# Altium schematic sheet Battery Load Share V2.SchDoc
size A; SheetNumber: 2; SheetTotal: 9
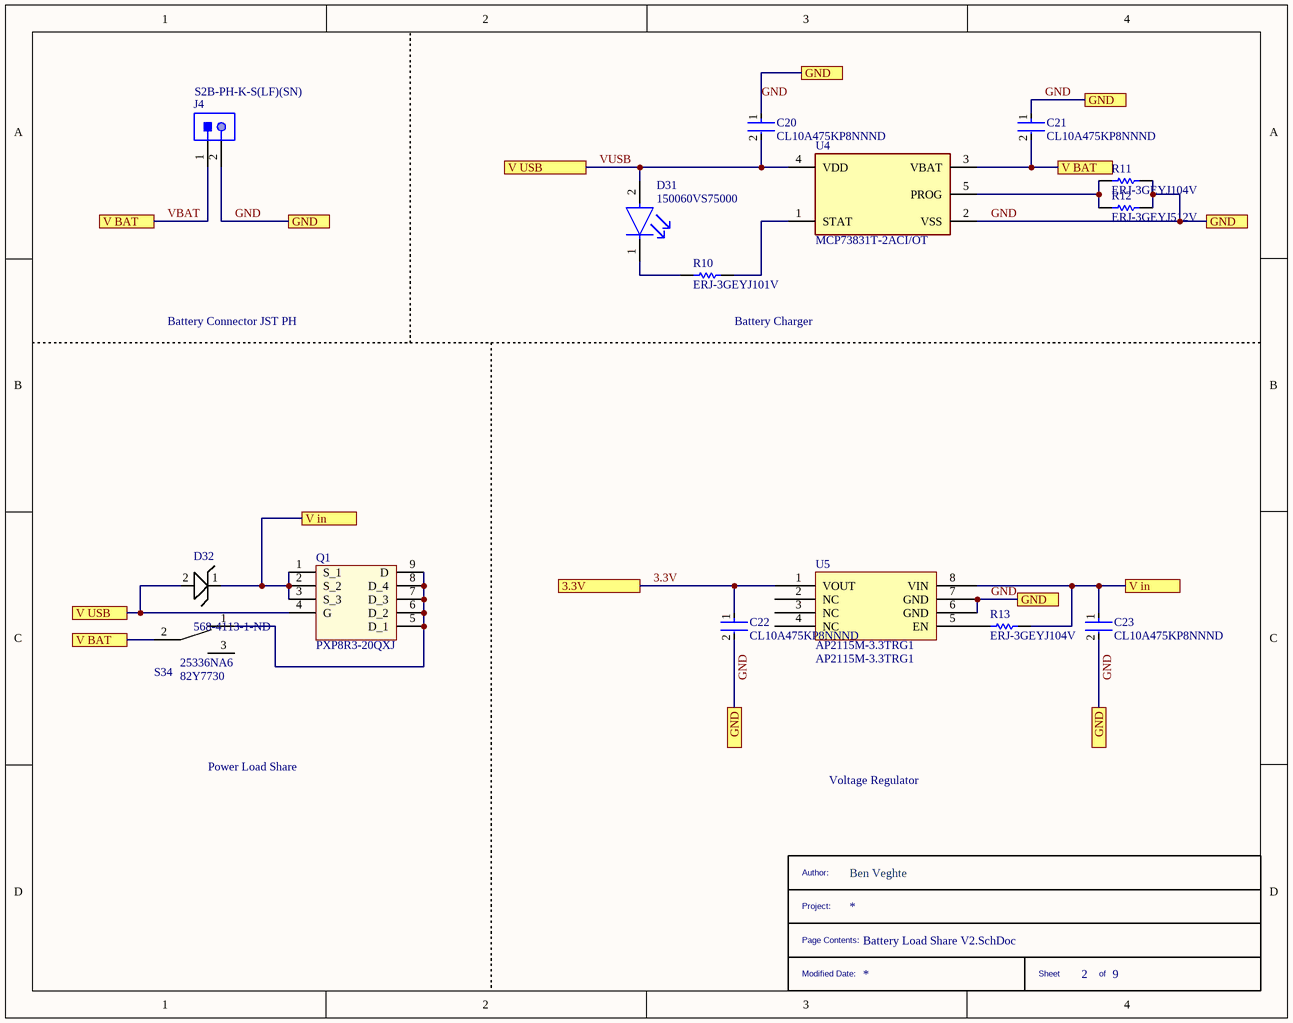
[diagram p0: Battery Load Share V2.SchDoc]

## Parts
*  __TITLE_BLOCK__  (value not drawn)  (graphical)
C20  CL10A475KP8NNND  [FP-CL10-IPC_C]
C21  CL10A475KP8NNND  [FP-CL10-IPC_C]
C22  CL10A475KP8NNND  [FP-CL10-IPC_C]
C23  CL10A475KP8NNND  [FP-CL10-IPC_C]
D31  150060VS75000  [FP-150060VS75000-MFG]
D32  Supplier Part Number 1: 568-4113-1-ND  [PMEG2010AEJ]  (hidden comment: PMEG2010AEJ115)
J4  S2B-PH-K-S(LF)(SN)  [JST-S2B-PH-K-S_V]
Q1  PXP8R3-20QXJ  [PXP8R3-20QXJ]
R10  ERJ-3GEYJ101V  [RESC1608X55X30LL15T15]
R11  ERJ-3GEYJ104V  [RESC1608X55X30NL15T15]
R12  ERJ-3GEYJ512V  [RESC1608X55X30LL15T15]
R13  ERJ-3GEYJ104V  [RESC1608X55X30NL15T15]
S34  25336NA6  Supplier Part Number 1: 82Y7730  [25336NA6]
U4  MCP73831T-2ACI/OT  [FP-C04-091-OT-IPC_B]
U5  AP2115M-3.3TRG1  [AP2115M-3.3TRG1]

## Ports
3.3V, GND, V BAT, V in, V USB

## Nets
3.3V: C22.1 U5.1(VOUT) ; port 3.3V
GND: C20.1 C21.1 C22.2 C23.2 J4.2 R11.2 R12.2 U4.2(VSS) U5.6(GND) U5.7(GND) ; port GND
V in: C23.1 D32.1 Q1.1(S_1) Q1.2(S_2) Q1.3(S_3) R13.2 U5.8(VIN) ; port V in
VBAT: C21.2 J4.1 S34.2 U4.3(VBAT) ; port V BAT
VUSB: C20.2 D31.2(A) D32.2 Q1.4(G) U4.4(VDD) ; port V USB
NetD31_1: D31.1(C) R10.1
NetQ1_5: Q1.5(D_1) Q1.6(D_2) Q1.7(D_3) Q1.8(D_4) Q1.9(D) S34.1
NetR10_2: R10.2 U4.1(STAT)
NetR11_1: R11.1 R12.1 U4.5(PROG)
NetR13_1: R13.1 U5.5(EN)

Not connected (* = marked no-connect by the designer): S34 3; U5 2(NC) 3(NC) 4(NC)

## Notes on the sheet
- Battery Connector JST PH
- (near R10) Battery Charger
- Power Load Share
- Voltage Regulator
- (in symbol __TITLE_BLOCK__) Author:; Ben Veghte; Project:; Page Contents:; Modified Date:; Sheet; of

## Library data of the parts
C20-C23 = CMP-13271-003065-1: Cap Ceramic 4.7uF 10V X5R ±10% Pad SMD 0603 +85°C T/R; Height: 0.8mm; Tolerance: 10%; Capacitance: 4.7uF; Voltage Rating: 10V; Voltage Rating (DC): 10V; Packaging: Tape and Reel; Dielectric: X5R; Width: 0.031inch; Max Operating Temperature: 85°C; Radiation Hardening: No; Package Quantity: 10000; Case/Package: 0603; Mount: Surface Mount; Min Operating Temperature: -55°C; Thickness: 0.035inch; Length: 1.6mm; Depth: 0.8mm
D31 = CMP-1426-00006-5: LED GREEN CLEAR 0603 SMD; Viewing Angle: 140°; Reverse Voltage (DC): 5V; Forward Voltage: 2V; Power Rating: 72mW; Lens Size: 0.7mm; Test Current: 20mA; Lens Color: Colorless; Lens Style: Rectangular; Luminous Intensity: 40mcd; Wavelength: 570nm; Length: 1.6mm; Max Operating Temperature: 85°C; Lens Transparency: Clear; Width: 0.8mm; Mount: Surface Mount; Weight: 0.000882oz; Package Quantity: 4000; Packaging: Cut Tape; RoHS Compliant: Yes; Case/Package: 0603; Series: WL-SMCW; Case Code (Metric): 1608; Illumination Color: Green; Color: Green; Case Code (Imperial): 0603; Forward Current: 20mA; Min Operating Temperature: -40°C; Height: 0.8mm; Dominant Wavelength: 570nm; Number of Pins: 2
D32 = PMEG2010AEJ115: NXP         PMEG2010AEJ,115             Schottky Rectifier, Single, 20 V, 1 A, SOD-323F, 2 Pins, 550 mV; Manufacturer: NXP Semiconductors; Max Surge Current: 10A; Forward Current: 1A; Max Reverse Current: 70uA; Forward Voltage: 550mV; Max Repetitive Reverse Voltage (Vrrm): 20V; Supplier 1: Digi-Key; Manufacturer Part Number: PMEG2010AEJ115; RoHS: Yes; Category: Schottky Diodes; Mount: Surface Mount; Number of Pins: 2; Weight: 0.01lb; Min Operating Temperature: -65°C; Max Operating Temperature: 150°C; Package Quantity: 1; Packaging: Tape and Reel; Max Reverse Leakage Current: 70uA; Average Rectified Current: 1A; Peak Non-Repetitive Surge Current: 10A; Max Forward Surge Current (Ifsm): 10A; Termination: SMD/SMT; Element Configuration: Single; Max Reverse Voltage (DC): 20V; Length: 0.25inch; Width: 0.25inch; Height: 0.25inch; Radiation Hardening: No; REACH SVHC: No SVHC; Lead Free: Lead Free; ComponentLink1URL: https://datasheet.ciiva.com/28648/666247-28648370.pdf?src-supplier=Element14; ComponentLink1Description: https://datasheet.ciiva.com/28648/666247-28648370.pdf?src-supplier=Element14; ComponentLink2URL: https://datasheet.ciiva.com/913/pmeg2010aej-913523.pdf?src-supplier=Digi-Key; ComponentLink2Description: https://datasheet.ciiva.com/913/pmeg2010aej-913523.pdf?src-supplier=Digi-Key; ComponentLink3URL: https://datasheet.ciiva.com/4714/pmeg2010aej-117858-4714480.pdf?src-supplier=Mouser; ComponentLink3Description: https://datasheet.ciiva.com/4714/pmeg2010aej-117858-4714480.pdf?src-supplier=Mouser; ComponentLink4URL: https://datasheet.ciiva.com/7965/666247-7965049.pdf?src-supplier=Element14; ComponentLink4Description: https://datasheet.ciiva.com/7965/666247-7965049.pdf?src-supplier=Element14; ComponentLink5URL: https://datasheet.ciiva.com/31423/666247-31423031.pdf?src-supplier=Farnell; ComponentLink5Description: https://datasheet.ciiva.com/31423/666247-31423031.pdf?src-supplier=Farnell; ComponentLink6URL: https://datasheet.ciiva.com/913/pmeg2010aej-913524.pdf?src-supplier=Digi-Key; ComponentLink6Description: https://datasheet.ciiva.com/913/pmeg2010aej-913524.pdf?src-supplier=Digi-Key; ComponentLink7URL: https://datasheet.ciiva.com/913/pmeg2010aej-913525.pdf?src-supplier=Digi-Key; ComponentLink7Description: https://datasheet.ciiva.com/913/pmeg2010aej-913525.pdf?src-supplier=Digi-Key
J4 = CMP-1755-00004-1: Male Header, Pitch 2 mm, 1 x 2 Position, Height 4.8 mm, Tail Length 3.4 mm, -25 to 85 degC, RoHS, Bulk; Case\Package: Radial; Tolerance: 20%; Capacitance: 10 uF; Voltage Rating (DC): 50 V; Packaging: Bulk; ComponentLink1URL: http://www.jst-mfg.com/product/pdf/eng/ePH.pdf; Radiation Hardening: No; Height: 11 mm; Package Quantity: 200; PackageDescription: Male Header, Pitch 2 mm, 1 x 2 Position, Height 4.8 mm, Tail Length 3.4 mm; PackageReference: S2B-PH-K-S; Diameter: 5 mm; Pins: 2; Mount: Through Hole; Max Operating Temperature: 85 degC; Min Operating Temperature: -40 degC; ComponentLink1Description: Datasheet; DatasheetVersion: Dec-12; Length: 11 mm; Lead Pitch: 2 mm; REACH SVHC: No SVHC; Voltage Rating: 50 V; RoHSCompliant: true
Q1 = PXP8R3-20QXJ: PXP8R3-20QX - 20 V, P-channel Trench MOSFET; Manufacturer: Nexperia; Supplier 1: Arrow Electronics; Manufacturer Part Number: PXP8R3-20QXJ; RoHS: No; Category: Uncategorized; Stock 1: 1756; Pricing 1: 1=0.70830, 10=0.62250, 25=0.61630, 50=0.61020, 100=0.46530, 250=0.46060, 500=0.34520, 1000=0.29630 (USD); Supplier Part Number 1: PXP8R3-20QXJ
R10 = CMP-2000-00702-1: Manufacturer: Panasonic; Part Number: ERJ-3GEYJ101V
R11 R13 = CMP-2000-00705-1: Manufacturer: Panasonic; Part Number: ERJ-3GEYJ104V
R12 = CMP-2000-00803-1: Manufacturer: Panasonic; Part Number: ERJ-3GEYJ512V
S34 = 25336NA6: Switch Slide ON ON SPDT Side Slide 1A 30VDC 20000Cycles PC Pins Thru-Hole; Manufacturer: APEM; Actuator Material: Nylon,Glass,Polyamide; Contact Current Rating: 4A; Voltage Rating (AC): 125V; Max Voltage Rating (AC): 250V; Voltage Rating (DC): 30V; Illumination Type: Non-Illuminated; Electrical Life: 10000Cycles; Switch Travel: 4mm; Switch Function: On-On; Actuator Type: Standard; Actuator Length: 6mm; Supplier 1: Newark; Manufacturer Part Number: 25336NA6; RoHS: Yes; Category: Slide Switches; Stock 1: 209; Pricing 1: 1=4.37000, 10=3.91000, 25=3.70000, 50=3.57000, 100=3.38000, 250=3.13000 (USD); Mount: Through Hole; Contact Plating: Silver; Contact Material: Silver; Mechanical Life: 20000Cycles; Min Operating Temperature: -40°C; Max Operating Temperature: 85°C; Package Quantity: 100; Throw Configuration: SPDT; Max Current Rating: 1A; Packaging: Bulk; Current Rating: 1A; Max Voltage Rating (DC): 30V; Termination: PC Pins; Orientation: Right Angle; Length: 14.1mm; Depth: 13.5mm; REACH SVHC: No SVHC; RoHS Compliant: Yes; ComponentLink1URL: https://datasheet.ciiva.com/22638/1686052-22638216.pdf?src-supplier=Element14; ComponentLink1Description: https://datasheet.ciiva.com/22638/1686052-22638216.pdf?src-supplier=Element14
U4 = CMP-0133-00143-2: IC CONTROLLR LI-ION 4.2V SOT23-5; Max Power Dissipation: 1.54W; Output Current: 500mA; Max Output Voltage: 4.5V; Number of Outputs: 1; Min Output Voltage: 4.168V; Min Supply Voltage: 3.75V; Max Input Voltage: 6V; Voltage Rating: 4.534V; Drain to Source Resistance: 350mR; Max Operating Temperature: 85°C; Length: 0.122inch; Number of Pins: 5; REACH SVHC: No SVHC; Radiation Hardening: No; Min Operating Temperature: -40°C; Weight: 0.00709oz; Contact Plating: Tin; Termination: SMD/SMT; Case/Package: SOT-23; Mount: Surface Mount; Width: 0.071inch; Packaging: Tape and Reel; Number of Cells: 1; Max Charge Current: 500mA; Height: 0.051inch; Number of Channels: 1; Output Voltage: 4.2V; Max Supply Voltage: 6V; Lead Free: Lead Free
U5 = AP2115M-3.3TRG1: LDO Regulator Pos 3.3V 1A 8-Pin SOIC T/R; Manufacturer: Diodes; Dropout Voltage: 450mV; Number of Regulators: 1; Supplier 1: Arrow Electronics; Manufacturer Part Number: AP2115M-3.3TRG1; RoHS: Yes; Category: Voltage Regulators - Linear; Stock 1: 3960; Pricing 1: 1=0.39860, 10=0.32620, 25=0.30340, 100=0.20830, 250=0.19280, 500=0.15840, 1000=0.11820, 3000=0.11710 (USD); Mount: Surface Mount; Case/Package: SOIC; Min Operating Temperature: -40°C; Max Operating Temperature: 85°C; Packaging: Tape and Reel; Output Voltage: 3.3V; Output Current: 1A; RoHS Compliant: Yes; ComponentLink1URL: http://www.mouser.com/ds/2/115/AP2115-464923.pdf?src-supplier=Mouser; ComponentLink1Description: http://www.mouser.com/ds/2/115/AP2115-464923.pdf?src-supplier=Mouser; ComponentLink2URL: https://www.diodes.com/assets/Datasheets/AP2115.pdf?src-supplier=Digi-Key; ComponentLink2Description: https://www.diodes.com/assets/Datasheets/AP2115.pdf?src-supplier=Digi-Key; Supplier Part Number 1: AP2115M-3.3TRG1